# EAGLE design sonoff DIY, 3 gang(Smd version-V.1.3) (EAGLE 9.6.2)
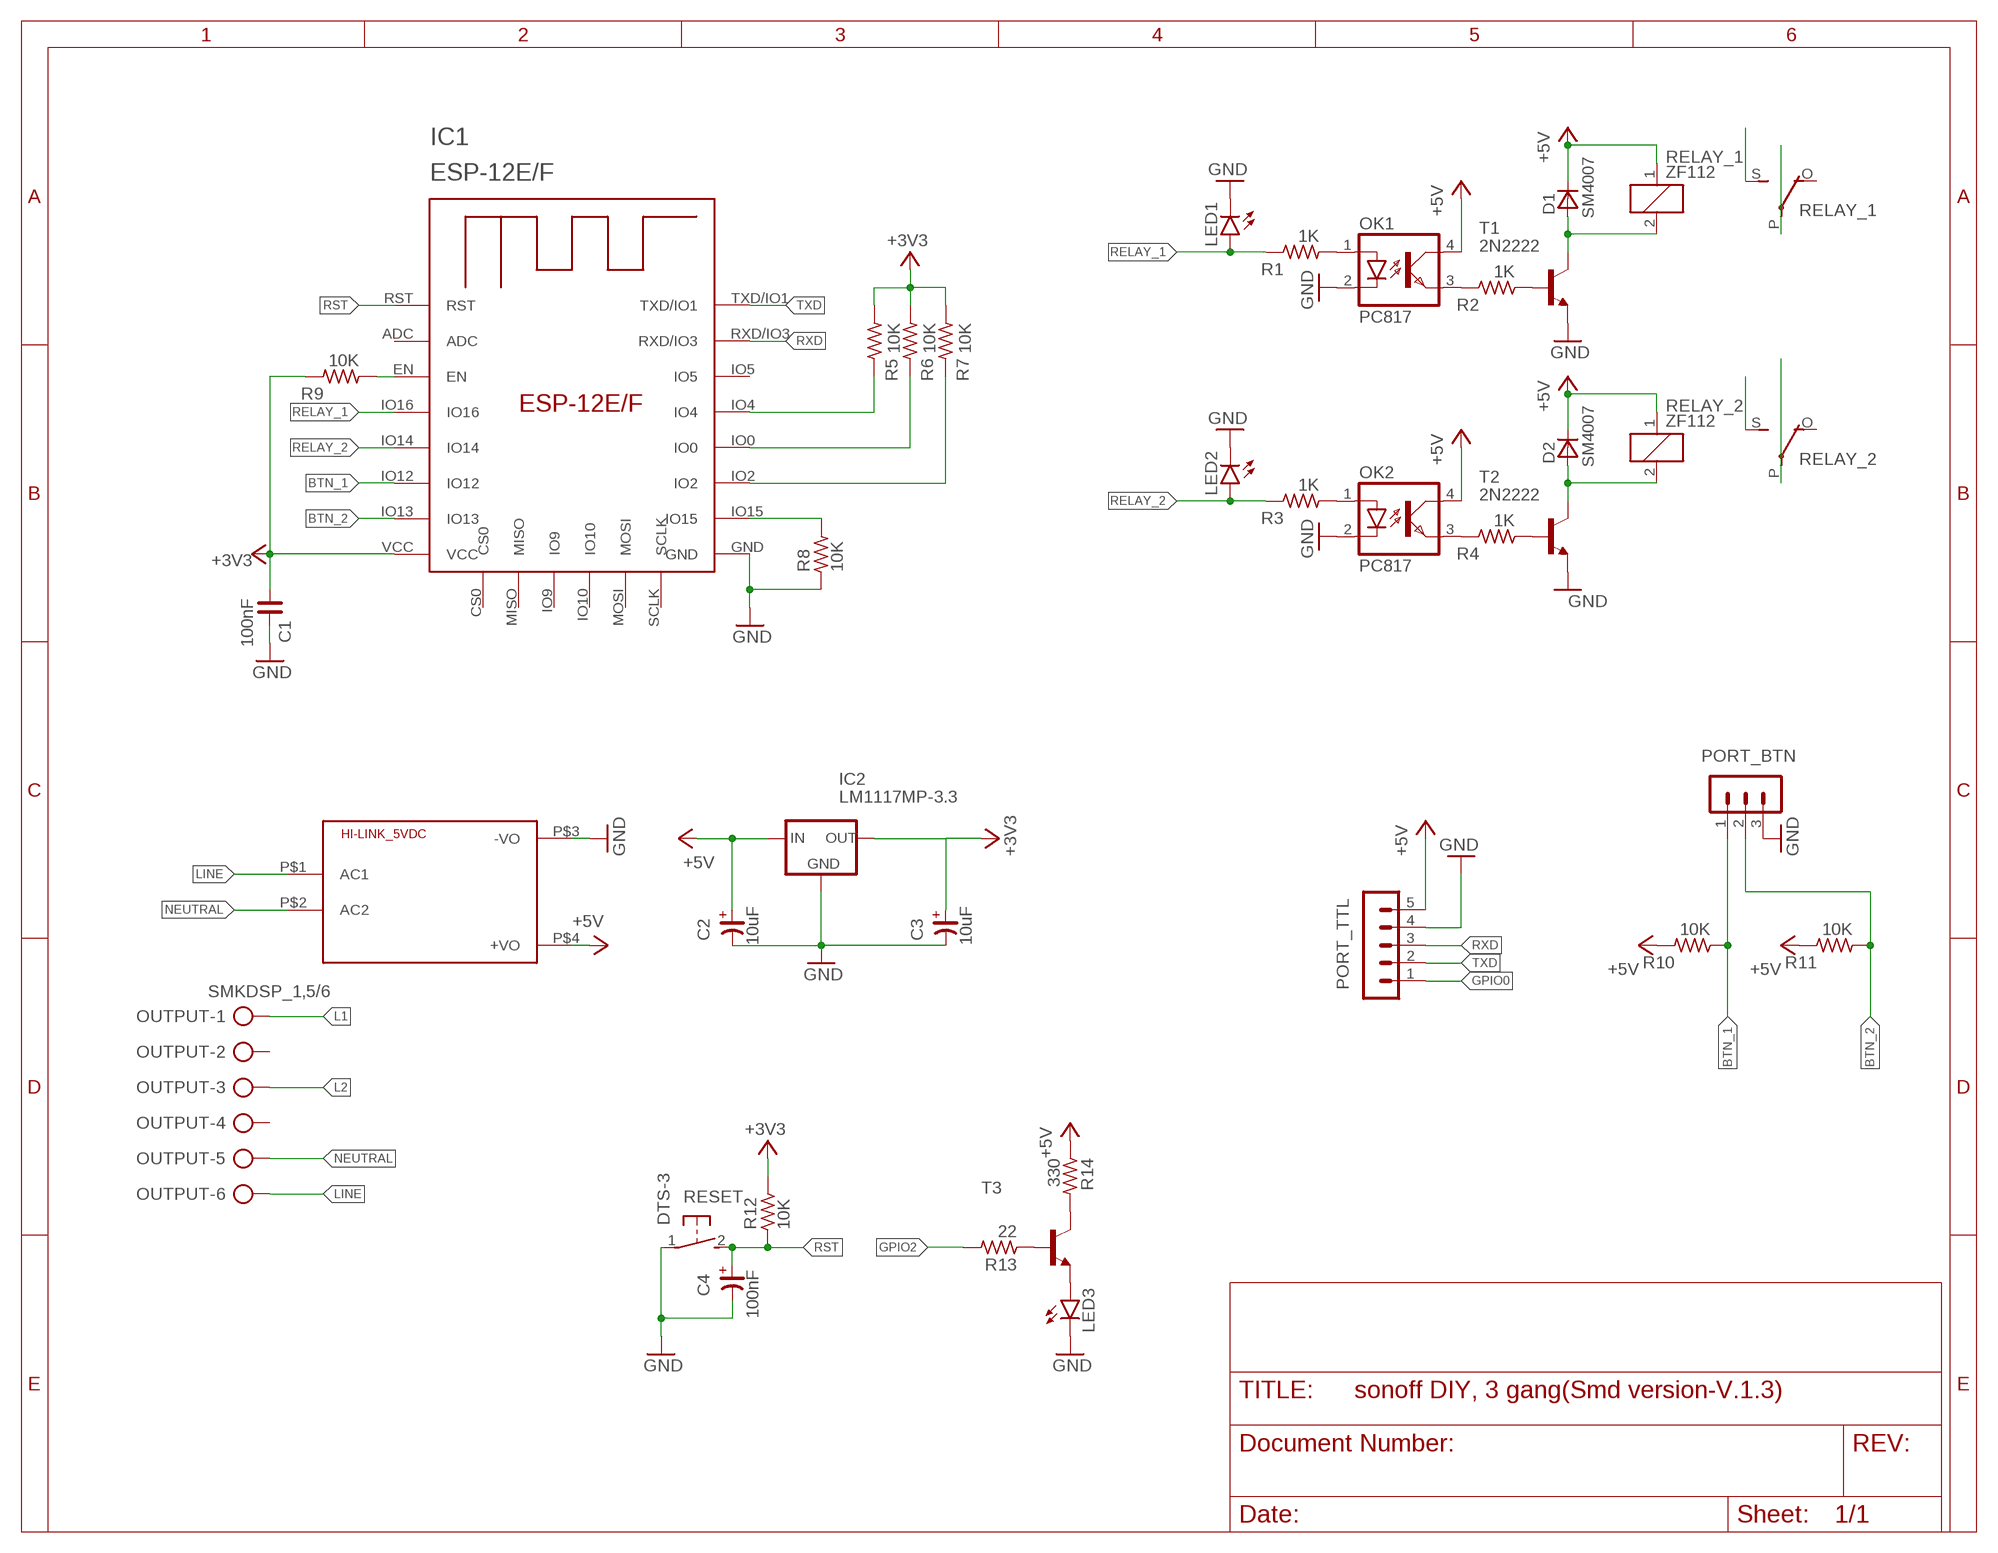
[diagram p0: schematic, sheet 1]

## Parts
C1  100nF  C_0805  [C0805]
C2  10uF  CP_3528  [C3528/T]
C3  10uF  CP_3528  [C3528/T]
C4  100nF  CP_3528  [C3528/T]
D1  SM4007  [MELF-MLL41]
D2  SM4007  [MELF-MLL41]
HI-LINK_5VDC  HLK-PM013W  [HLK-PM01]
IC1  ESP-12E/F  [ESP-12E]
IC2  LM1117MP-3.3  [SOT223]
LED1  LED3MM  [LED3MM]
LED2  LED3MM  [LED3MM]
LED3  LED3MM  [LED3MM]
OK1  PC817  [DIL04]
OK2  PC817  [DIL04]
OUTPUT  SMKDSP_1,5/6  [SMKDSP_1,5/6]
PORT_BTN  MA03-1  [MA03-1]
PORT_TTL  MA05-1  [MA05-1]
R1  1K  R_0805  [R0805]
R2  1K  R_0805  [R0805]
R3  1K  R_0805  [R0805]
R4  1K  R_0805  [R0805]
R5  10K  R_0805  [R0805]
R6  10K  R_0805  [R0805]
R7  10K  R_0805  [R0805]
R8  10K  R_0805  [R0805]
R9  10K  R_0805  [R0805]
R10  10K  R_0805  [R0805]
R11  10K  R_0805  [R0805]
R12  10K  R_0805  [R0805]
R13  22  R_0805  [R0805]
R14  330  R_0805  [R0805]
RELAY_1  ZF112  [ZF112]
RELAY_2  ZF112  [ZF112]
RESET  DTS-3  [DTS-3]
T1  2N2222  [TO18]
T2  2N2222  [TO18]
T3  BC817-16LT1-NPN-SOT23-BEC  [SOT23-BEC]

## Nets
+3V3: C1.1 C3.+ IC1.VCC IC2.2(OUT) IC2.4(OUT) R5.1 R6.1 R7.1 R9.2 R12.2
+5V: C2.+ D1.C D2.C HI-LINK_5VDC.P$4(+VO) IC2.3(IN) OK1.4(COL) OK2.4(COL) PORT_TTL.5 R10.2 R11.2 R14.1 RELAY_1.1 RELAY_2.1
BTN_1: IC1.IO12 PORT_BTN.1 R10.1
BTN_2: IC1.IO13 PORT_BTN.2 R11.1
GND: C1.2 C2.- C3.- C4.- HI-LINK_5VDC.P$3(-VO) IC1.GND IC2.1(GND) LED1.K(C) LED2.K(C) LED3.K(C) OK1.2(C) OK2.2(C) PORT_BTN.3 PORT_TTL.4 R8.1 RESET.1 T1.1(E) T2.1(E)
GPIO0: IC1.IO0 PORT_TTL.1 R6.2
GPIO2: IC1.IO2 R7.2 R13.2
L1: OUTPUT.1 RELAY_1.S(2:S)
L2: OUTPUT.3 RELAY_2.S(2:S)
LINE: HI-LINK_5VDC.P$1(AC1) OUTPUT.6 RELAY_1.P(2:P) RELAY_2.P(2:P)
N$1: OK1.3(EMIT) R2.2
N$2: R2.1 T1.2(B)
N$3: OK2.1(A) R3.1
N$4: D1.A RELAY_1.2 T1.3(C)
N$5: OK2.3(EMIT) R4.2
N$6: R4.1 T2.2(B)
N$8: OK1.1(A) R1.1
N$9: IC1.IO4 R5.2
N$10: D2.A RELAY_2.2 T2.3(C)
N$11: LED3.A T3.E
N$14: IC1.IO15 R8.2
N$18: R13.1 T3.B
N$19: IC1.EN R9.1
N$21: R14.2 T3.C
NEUTRAL: HI-LINK_5VDC.P$2(AC2) OUTPUT.5
RELAY_1: IC1.IO16 LED1.A R1.2
RELAY_2: IC1.IO14 LED2.A R3.2
RST: C4.+ IC1.RST R12.1 RESET.2
RXD: IC1.RXD/IO3 PORT_TTL.3
TXD: IC1.TXD/IO1 PORT_TTL.2
Unconnected: IC1.ADC IC1.CS0 IC1.IO5 IC1.IO9 IC1.IO10 IC1.MISO IC1.MOSI IC1.SCLK OUTPUT.2 OUTPUT.4 RELAY_1.O(2:O) RELAY_2.O(2:O)

## Library data of the parts
C1 = rc-master-smd:C_: NON-POLARIZED CAP
C2-C4 = rc-master-smd:CP_: POLARIZED CAP
D1 D2 = _mod_diode:SM400*: SM4001 .. SM4007 General Purpose Rectifier, 1 A SMD-Version of 1N4001 .. 1N4007 Case: MELF-MLL41 = DO 213 AB Author: Dipl.-Ing. FH Rainer Bayer HHN Hochschule Heilbronn, rainer.bayer@hs-heilbronn.de Ingenieurbüro ing-rb, mail@ing-rb.de
HI-LINK_5VDC = HLK-PM01:HLK-PM01: Hi-Link Power Supply HLK-PM01 3W Author: Ahmed Said <https://github.com/AhmedSaid/EAGLELibraries>
IC1 = esp-12e-f:ESP-12E/F
IC2 = lm1117_11:LM1117?-*: 800mA Low-Dropout Linear Regulator Source: http://www.ti.com/lit/ds/symlink/lm1117-n.pdf; MF: Texas Instruments; MPN: LM1117MP-3.3; OC_FARNELL: 9778195; OC_NEWARK: 28X3416
LED1-LED3 = led:LED: LED OSRAM: - CHIPLED LG R971, LG N971, LY N971, LG Q971, LY Q971, LO R971, LY R971 LH N974, LH R974 LS Q976, LO Q976, LY Q976 LO Q996 - Hyper CHIPLED LW Q18S LB Q993, LB Q99A, LB R99A - SideLED LS A670, LO A670, LY A670, LG A670, LP A670 LB A673, LV A673, LT A673, LW A673 LH A674 LY A675 LS A676, LA A676, LO A676, LY A676, LW A676 LS A679, LY A679, LG A679 - Hyper Micro SIDELED® LS Y876, LA Y876, LO Y876, LY Y876 LT Y87S - SmartLED LW L88C, LW L88S LB L89C, LB L89S, LG L890 LS L89K, LO L89K, LY L89K LS L896, LA L896, LO L896, LY L896 - TOPLED LS T670, LO T670, LY T670, LG T670, LP T670 LSG T670, LSP T670, LSY T670, LOP T670, LYG T670 LG T671, LOG T671, LSG T671 LB T673, LV T673, LT T673, LW T673 LH T674 LS T676, LA T676, LO T676, LY T676, LB T676, LH T676, LSB T676, LW T676 LB T67C, LV T67C, LT T67C, LS T67K, LO T67K, LY T67K, LW E67C LS E67B, LA E67B, LO E67B, LY E67B, LB E67C, LV E67C, LT E67C LW T67C LS T679, LY T679, LG T679 LS T770, LO T770, LY T770, LG T770, LP T770 LB T773, LV T773, LT T773, LW T773 LH T774 LS E675, LA E675, LY E675, LS T675 LS T776, LA T776, LO T776, LY T776, LB T776 LHGB T686 LT T68C, LB T68C - Hyper Mini TOPLED® LB M676 - Mini TOPLED Santana® LG M470 LS M47K, LO M47K, LY M47K Source: http://www.osram.convergy.de LUXEON: - LUMILED® LXK2-PW12-R00, LXK2-PW12-S00, LXK2-PW14-U00, LXK2-PW14-V00 LXK2-PM12-R00, LXK2-PM12-S00, LXK2-PM14-U00 LXK2-PE12-Q00, LXK2-PE12-R00, LXK2-PE12-S00, LXK2-PE14-T00, LXK2-PE14-U00 LXK2-PB12-K00, LXK2-PB12-L00, LXK2-PB12-M00, LXK2-PB14-N00, LXK2-PB14-P00, LXK2-PB14-Q00 LXK2-PR12-L00, LXK2-PR12-M00, LXK2-PR14-Q00, LXK2-PR14-R00 LXK2-PD12-Q00, LXK2-PD12-R00, LXK2-PD12-S00 LXK2-PH12-R00, LXK2-PH12-S00 LXK2-PL12-P00, LXK2-PL12-Q00, LXK2-PL12-R00 Source: www.luxeon.com KINGBRIGHT: KA-3528ASYC Source: www.kingbright.com
OK1 OK2 = optocoupler:PC817: SHARP OPTO COUPLER; MPN: PC817X4J000F; OC_FARNELL: 9707727; OC_NEWARK: 97K7059
OUTPUT = con-phoenix-smkdsp:SMKDSP_1,5/6: Printklemme, Nennstrom: 17,5 A, Bemessungsspannung: 250 V, Raster: 5,0 mm Source: http://eshop.phoenixcontact.de .. 1733415.pdf; MF: FARNELL; MPN: 1733619; OC_FARNELL: 3041270; OC_NEWARK: 71C4132
PORT_BTN = con-lstb:MA03-1: PIN HEADER; OC_FARNELL: unknown; OC_NEWARK: unknown
PORT_TTL = con-lstb:MA05-1: PIN HEADER; OC_FARNELL: unknown; OC_NEWARK: unknown
R1-R14 = rc-master-smd:R_: RESISTOR
RELAY_1 RELAY_2 = relay:ZF112: RELAY 1 x switch; OC_FARNELL: unknown; OC_NEWARK: unknown
RESET = switch-tact:DTS-3
T1 T2 = transistor:2N2222: NPN TRANSISTOR
T3 = transistor:*-NPN-: NPN Transistror BF959 corrected 2008.03.06

## Board
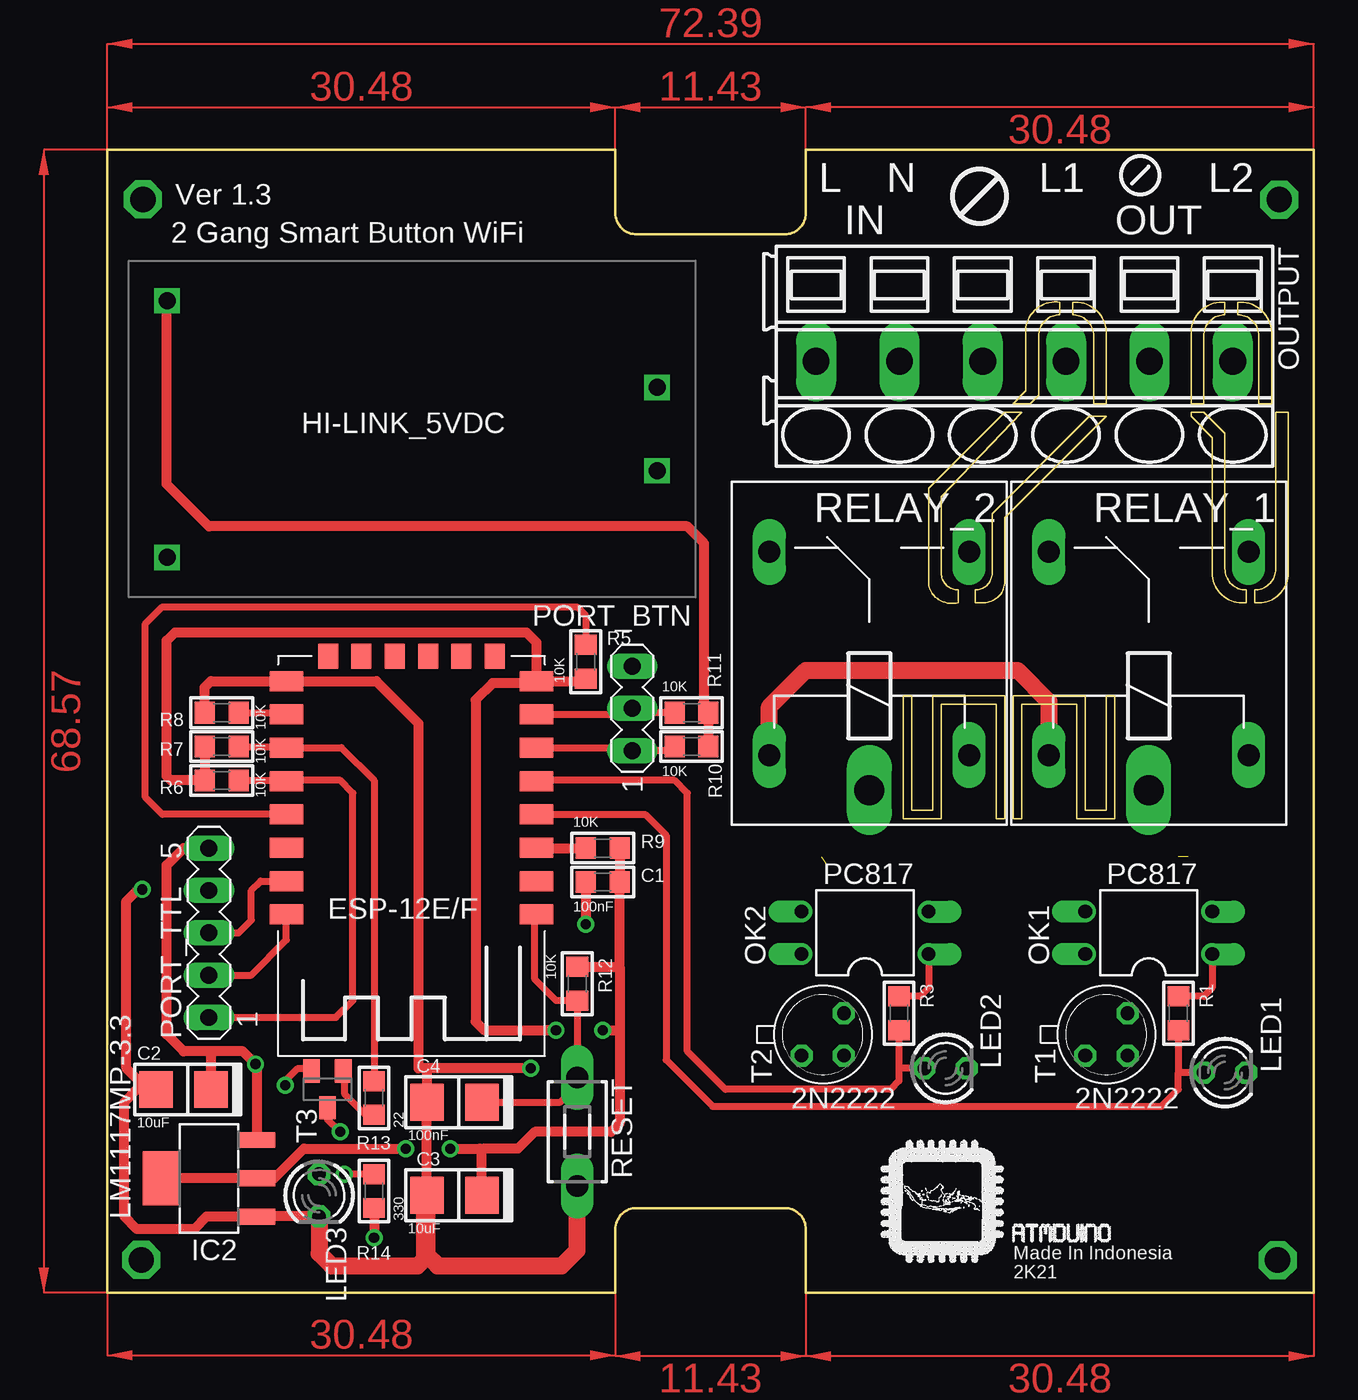
[diagram p1: board, top side]
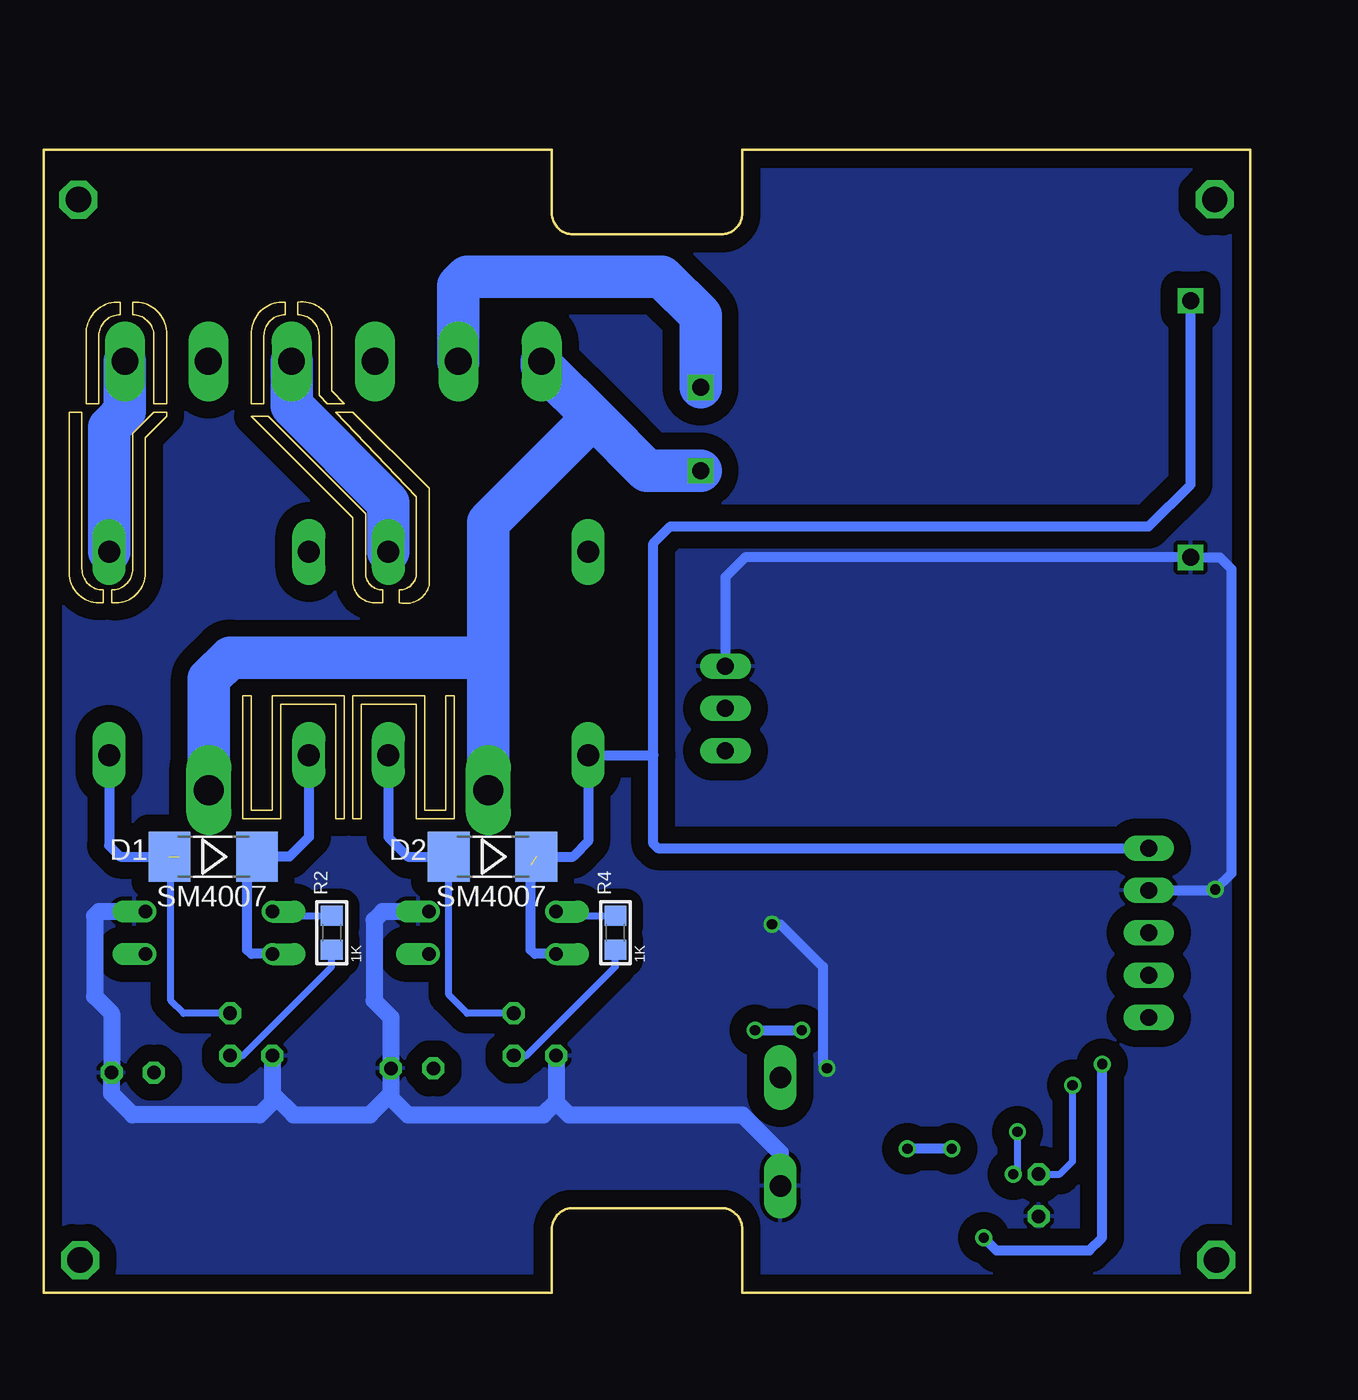
[diagram p2: board, bottom side, seen from below]

Size 72.39 x 68.58 mm. Coordinates in mm from the lower left corner, seen from the top.
Outline: 0,0 30.48,0 30.48,3.81 arc-90 31.75,5.08 40.64,5.08 arc-90 41.91,3.81 41.91,0 72.39,0 72.39,68.58 41.91,68.58 41.91,64.77 arc-90 40.64,63.5 31.75,63.5 arc-90 30.48,64.77 30.48,68.58 0,68.58 0,0
Outline: 53.09,46.74 53.09,43.18 arc-90 52.07,42.16 52.07,41.4 52.58,41.4 arc90 53.85,42.67 53.85,46.48 59.94,52.58 58.93,52.58 53.09,46.74
Outline: 54.86,52.83 50.04,47.75 50.04,43.18 arc90 51.05,42.16 51.05,41.4 arc-90 49.28,42.42 49.28,48.26 53.85,52.83 54.86,52.83
Outline: 67.06,51.56 67.06,43.43 arc90 68.33,42.16 68.33,41.4 68.07,41.4 arc-90 66.29,43.18 66.29,51.31 65.02,52.58 65.02,52.83 65.79,52.83 67.06,51.56
Outline: 68.83,42.16 68.83,41.4 69.09,41.4 arc90 70.87,43.18 70.87,52.83 70.1,52.83 70.1,43.43 arc-90 68.83,42.16
Outline: 55.88,57.4 55.88,53.85 55.37,53.34 54.36,53.34 55.12,54.1 55.12,57.91 arc-90 57.15,59.44 57.15,58.67 arc90 55.88,57.4
Outline: 57.91,59.44 arc-90 59.94,57.66 59.94,53.34 59.18,53.34 59.18,57.4 arc90 57.91,58.67 57.91,59.44
Outline: 67.82,59.44 arc-90 69.85,57.66 69.85,53.34 69.09,53.34 69.09,57.4 arc90 67.82,58.67 67.82,59.44
Outline: 67.06,59.44 arc90 65.02,57.66 65.02,53.34 65.79,53.34 65.79,57.4 arc-90 67.06,58.67 67.06,59.44
Outline: 47.75,28.45 50.04,28.45 50.04,35.31 53.34,35.31 53.34,28.45 53.85,28.45 53.85,35.81 49.53,35.81 49.53,28.96 48.26,28.96 48.26,35.81 47.75,35.81 47.75,28.45
Outline: 54.36,35.81 54.36,28.45 54.86,28.45 54.86,35.31 58.17,35.31 58.17,28.45 60.45,28.45 60.45,35.81 59.94,35.81 59.94,28.96 58.67,28.96 58.67,35.81 54.36,35.81
Copper layers (1*16): Top 0.035mm / dielectric 1.5mm / Bottom 0.035mm
Design rules "default": minimum track width 10mil, minimum drill 24mil, track to track 8mil, track to pad 8mil, pad to pad 8mil, via to via 8mil, smd to smd 8mil, copper to edge 40mil, drill to drill 8mil, minimum pad ring 10mil, minimum via ring 8mil, stop-mask expansion 4mil, vias tented up to drill 0mil, thermal gap 10mil

### Footprints (pad centres in the part's own frame; a part is rotated, then mirrored left to right if it is on the bottom)
C0805 = smd 1.2 x 1.3: 1 -1.016,0; 2 1.016,0
C3528/T = smd 2 x 2.2: + 1.651,0; - -1.651,0
MELF-MLL41 = smd 2.5 x 3: A 2.625,0; C -2.625,0
HLK-PM01 = drill 1.016 square: P$1 -14.7,2.5; P$2 -14.7,-2.5; P$3 14.7,7.7; P$4 14.7,-7.7
ESP-12E = smd 2 x 1.2: ADC -7.46,5.53; EN -7.46,3.53; GND 7.54,-6.47; IO0 7.54,-0.47; IO2 7.54,-2.47; IO4 7.54,1.53; IO5 7.54,3.53; IO12 -7.46,-2.47; IO13 -7.46,-4.47; IO14 -7.46,-0.47; IO15 7.54,-4.47; IO16 -7.46,1.53; RST -7.46,7.53; RXD/IO3 7.54,5.53; TXD/IO1 7.54,7.53; VCC -7.46,-6.47 | smd 1.2 x 1.5: CS0 -4.96,-7.97; IO9 -0.96,-7.97; IO10 1.04,-7.97; MISO -2.96,-7.97; MOSI 3.04,-7.97; SCLK 5.04,-7.97
SOT223 = smd 0.95 x 2.15: 1 -2.3,-2.9; 2 0,-2.9; 3 2.3,-2.9 | smd 3.25 x 2.15: 4 0,2.9
LED3MM = drill 0.813 octagon: A -1.27,0; K 1.27,0
DIL04 = drill 0.813 offset: 1 -1.27,-3.81; 2 1.27,-3.81; 3 1.27,3.81; 4 -1.27,3.81
SMKDSP_1,5/6 = drill 1.6 pad 1.8 long: 1 -2.5,0; 2 2.5,0; 3 7.5,0; 4 12.5,0; 5 17.5,0; 6 22.5,0
MA03-1 = drill 1.016 long: 1 -2.54,0; 2 0,0; 3 2.54,0
MA05-1 = drill 1.016 long: 1 -5.08,0; 2 -2.54,0; 3 0,0; 4 2.54,0; 5 5.08,0
R0805 = smd 1.2 x 1.3: 1 -1.016,0; 2 1.016,0
ZF112 = drill 1.321 long: 1 -6.096,5.994; 2 -6.096,-5.994; O 6.096,5.994; S 6.096,-5.994 | drill 1.803 long: P -8.204,0
DTS-3 = drill 1.3 long: 1 -3.25,0; 2 3.25,0
TO18 = drill 0.813 octagon: 1 -1.27,-1.27; 2 1.27,-1.27; 3 1.27,1.27
SOT23-BEC = smd 1 x 1.4: B -0.95,-1.1; C 0,1.1; E 0.95,-1.1

### Placement (x,y rotation side)
C1  29.72,24.64 180 top
C2  4.57,12.19 0 top
C3  20.83,5.84 0 top
C4  20.83,11.43 0 top
D1  62.23,26.16 180 bottom
D2  45.47,26.16 180 bottom
HI-LINK_5VDC  18.29,51.82 180 top
IC1  18.29,30.23 180 top
IC2  6.1,6.86 90 top
LED1  67.06,13.21 0 top
LED2  50.29,13.46 0 top
LED3  12.7,5.84 270 top
OK1  62.48,21.59 90 top
OK2  45.47,21.59 90 top
OUTPUT  65.02,55.88 180 top
PORT_BTN  31.5,35.05 90 top
PORT_TTL  6.1,21.59 90 top
R1  64.26,16.76 270 top
R2  55.12,21.59 90 bottom
R3  47.5,16.76 270 top
R4  38.1,21.59 90 bottom
R5  28.7,37.85 90 top
R6  6.86,30.73 0 top
R7  6.86,32.77 0 top
R8  6.86,34.8 0 top
R9  29.72,26.67 0 top
R10  35.05,32.77 0 top
R11  35.05,34.8 0 top
R12  28.19,18.54 90 top
R13  16,11.68 90 top
R14  16,6.1 90 top
RELAY_1  62.48,38.35 90 top
RELAY_2  45.72,38.35 90 top
RESET  28.19,9.65 90 top
T1  59.94,15.49 0 top
T2  42.93,15.49 0 top
T3  13.21,12.19 180 top

### Tracks (layer width: path | path; a pad name or v marks a point on that pad's centre or on a via)
+3V3  (via drill 0.61)
  Top 0.61: IC1.VCC 28.57,36.7 R5.1 | R7.1 R6.1 3.81,30.73 3.56,30.99 3.56,39.12 4.06,39.62 25.15,39.62 25.75,39.02 IC1.VCC | R9.2 C1.1 30.73,19.56 | IC2.4 IC2.2 10.01,6.86 11.79,8.64 v17.91,8.64 | R12.2 30.73,19.56 | 30.73,19.56 30.73,15.75 | 30.73,15.75 30.73,10.16 30.23,9.65 25.65,9.65 24.64,8.64 22.61,8.64 22.48,8.51 | IC1.VCC 25.63,36.58 23.11,36.58 22.1,35.56 22.1,16.26 22.61,15.75 26.42,15.75 v26.92,15.75 | v29.72,15.75 30.73,15.75 | C3.+ 22.48,8.51 | v20.57,8.64 22.35,8.64 22.48,8.51
  Bottom 0.61: v29.72,15.75 v26.92,15.75 | v17.91,8.64 v20.57,8.64
+5V  (via drill 0.61)  (1 unrouted)
  Top 0.61: R10.2 R11.2 35.81,35.05 35.81,44.96 34.8,45.97 6.1,45.97 3.56,48.51 3.56,59.48 HI-LINK_5VDC.P$4 | IC2.3 9,13.61 v8.89,13.72 8.13,14.48 6.1,14.48 | C2.+ 6.22,14.35 6.1,14.48 | 6.1,14.48 4.57,14.48 3.56,15.49 3.56,25.65 4.57,26.67 PORT_TTL.5 | R14.1 v16,3.3
  Top 1.016: RELAY_1.1 56.49,35.46 54.61,37.34 41.91,37.34 39.73,35.15 RELAY_2.1
  Bottom 0.61: RELAY_1.1 56.49,27.33 57.66,26.16 D1.C 59.61,26.84 59.69,26.92 59.69,25.91 60.2,25.4 60.2,20.57 59.94,20.32 OK1.4 | OK2.4 42.93,20.32 43.18,20.57 43.18,25.65 | D2.C 40.64,26.16 39.73,27.08 RELAY_2.1 35.81,32.26 | PORT_TTL.5 35.56,26.67 35.81,26.92 35.81,32.26 | 35.81,32.26 35.81,44.96 34.8,45.97 6.1,45.97 3.59,48.48 HI-LINK_5VDC.P$4 | v16,3.3 15.24,2.54 9.65,2.54 8.89,3.3 v8.89,13.72
BTN_1
  Top 0.406: 25.82,32.77 IC1.IO12 31.31,32.7 PORT_BTN.1 33.78,32.51 R10.1
  Top 0.61: R10.1 33.97,32.7
BTN_2
  Top 0.406: R11.1 31.75,34.8 PORT_BTN.2 31.14,34.7 IC1.IO13
  Top 0.61: 33.93,34.7 R11.1
GND  (via drill 0.61)
  Top 0.406: 10.61,36.83 IC1.GND
  Top 0.61: R8.1 5.84,36.32 6.22,36.7 IC1.GND 16.14,36.7 18.67,34.16 18.67,13.46 19.18,13.46 | 19.18,13.46 C4.- C3.- 19.05,5.71 | LED3.K 9.14,4.57 | IC2.1 5.95,4.56 5.2,3.81 1.78,3.81 1.02,4.57 1.02,11.43 1.78,12.19 C2.- 2.41,12.19 1.14,13.46 1.14,23.49 1.84,24.19 v2.1,24.19 | C1.2 v28.7,22.1 | v25.4,13.46 19.18,13.46
  Top 1.016: LED3.K 12.7,2.36 13.46,1.6 18.62,1.6 19.05,2.03 19.05,5.71 | C3.- 19.18,2.23 19.81,1.6 27.25,1.6 28.19,2.54 RESET.1
  Bottom 0.61: PORT_BTN.3 31.5,42.93 30.31,44.12 HI-LINK_5VDC.P$3 1.83,44.12 1.14,43.43 1.14,25.15 v2.1,24.19 2.16,24.13 PORT_TTL.4 | v28.7,22.1 28.19,22.1 25.65,19.56 25.65,13.72 v25.4,13.46
  Bottom 1.016: OK2.2 52.07,22.86 52.58,22.35 52.58,17.53 51.56,16.51 LED2.K 51.56,11.94 51.69,11.81 | 28.19,7.87 RESET.1 28.19,8.38 30.48,10.67 40.89,10.67 41.66,11.43 | T2.1 41.66,11.43 | 41.66,11.43 42.42,10.67 50.55,10.67 51.69,11.81 | 51.69,11.81 52.83,10.67 57.4,10.67 58.67,11.94 T1.1 58.67,11.43 59.44,10.67 67.06,10.67 68.33,11.94 LED1.K 68.33,16.76 69.34,17.78 69.34,22.61 69.09,22.86 OK1.2
  pour Bottom (isolate 1.016): 0,68.58 72.39,68.58 72.39,0 0,0
GPIO0
  Top 0.406: R6.2 10.71,30.73 | PORT_TTL.1 13.72,16.51 14.73,17.53 14.73,29.97 13.97,30.73 10.79,30.73
  Top 0.61: 10.71,30.73 IC1.IO0 10.79,30.73
GPIO2
  Top 0.406: R7.2 10.68,32.77 | IC1.IO2 14.04,32.7 16,30.73 R13.2
  Top 0.61: 10.68,32.77 IC1.IO2
L1
  Bottom 2.54: OUTPUT.1 67.52,52.87 68.48,51.92 RELAY_1.S
L2
  Bottom 2.54: RELAY_2.S 51.71,47.4 57.52,53.21 OUTPUT.3
LINE
  Bottom 2.54: HI-LINK_5VDC.P$1 36.21,49.32 39.17,52.27 | OUTPUT.6 42.52,55.63 39.17,52.27 | RELAY_2.P 45.72,38.1 | 45.72,38.1 45.72,46.23 39.68,52.27 39.17,52.27 | RELAY_1.P 62.48,36.83 61.21,38.1 45.72,38.1
N$1
  Bottom 0.406: OK1.3 58.42,22.61 R2.2
  Bottom 0.61: R2.2 55.37,22.86
N$2
  Bottom 0.406: T1.2 60.45,14.22 55.12,19.56 R2.1
N$3
  Top 0.406: OK2.1 49.28,18.29 48.77,17.78 R3.1
N$4  (1 unrouted)
  Bottom 0.406: T1.3 64.01,16.76 64.77,17.53 64.77,26.08 D1.A
  Bottom 0.61: RELAY_1.2 68.48,26.82 67.82,26.16 D1.A | 64.26,25.91 64.26,26.16
N$5
  Bottom 0.406: OK2.3 41.4,22.61 R4.2
  Bottom 0.61: R4.2 38.35,22.86
N$6
  Bottom 0.406: T2.2 43.43,14.22 38.1,19.56 R4.1
N$7  (via drill 1.52 pad 1.4)
  other vias: 70.22,1.95
N$8
  Top 0.406: OK1.1 66.29,18.29 65.79,17.78 R1.1
N$9
  Top 0.406: IC1.IO4 3.31,28.7 2.29,29.72 2.29,40.13 3.3,41.15 28.19,41.15 28.7,40.64 R5.2
N$10
  Bottom 0.406: T2.3 46.99,16.76 48.09,17.87 D2.A
  Bottom 0.61: RELAY_2.2 51.71,27.33 50.55,26.16 D2.A 48.09,25.99
N$11  (via drill 0.61)
  Top 0.406: v10.67,12.45 10.67,12.7 11.43,13.46 12.09,13.46 T3.E
  Bottom 0.406: LED3.A 11.43,7.11 10.67,7.87 v10.67,12.45
N$12  (via drill 1.52 pad 1.4)
  other vias: 70.31,65.58
N$13  (via drill 1.52 pad 1.4)
  other vias: 2.04,1.97
N$14
  Top 0.406: IC1.IO15 10.65,34.8 R8.2
N$17  (via drill 1.52 pad 1.4)
  other vias: 2.14,65.6
N$18
  Top 0.406: 14.22,13.23 14.22,11.94 15.43,10.73 15.94,10.73
  Top 0.61: 15.94,10.73 R13.1 | T3.B 14.22,13.23
N$19
  Top 0.406: 28.68,26.7 R9.1
  Top 0.61: IC1.EN 25.77,26.67 R9.1
N$21  (via drill 0.61)
  Top 0.406: R14.2 v14.22,7.11 | v13.97,9.65 13.21,10.41 T3.C
  Bottom 0.406: v14.22,7.11 13.97,7.37 v13.97,9.65
NEUTRAL
  Bottom 2.54: OUTPUT.5 47.52,60.43 46.99,60.96 35.31,60.96 32.99,58.64 HI-LINK_5VDC.P$2
RELAY_1
  Top 0.406: R1.2 64.26,13.21 | LED1.A 64.26,13.21 | IC1.IO16 32.26,28.7 33.53,27.43 33.53,13.97 36.32,11.18 63.25,11.18 64.26,12.19 64.26,13.21
  Top 0.61: IC1.IO16
RELAY_2
  Top 0.406: R3.2 47.5,13.46 | 47.5,13.46 47.5,12.7 46.99,12.19 37.08,12.19 34.8,14.48 34.8,29.97 34.04,30.73 26.42,30.73 | LED2.A 47.5,13.46
  Top 0.61: 26.42,30.73 26.16,30.48 25.96,30.48 IC1.IO14
RST
  Top 0.406: 25.65,22.6 25.65,18.8 26.92,17.53 R12.1 RESET.2 28.19,12.45 27.18,11.43 C4.+
  Top 0.61: 25.65,22.6 IC1.RST
RXD
  Top 0.406: PORT_TTL.3 7.87,21.59 8.64,22.35 8.64,24.13 9.2,24.7 IC1.RXD/IO3
TXD
  Top 0.406: PORT_TTL.2 8.64,19.05 10.75,21.16 IC1.TXD/IO1
(copper drawn outside any net)
  shapes: Top area x8

### Text on the board
tNames: L | N | L1 | L2 | Ver 1.3 | 2 Gang Smart Button WiFi | IN | OUT | Made In Indonesia | 2K21